# EAGLE schematic IQOV-162 Evo Board (EAGLE 9.7.0)
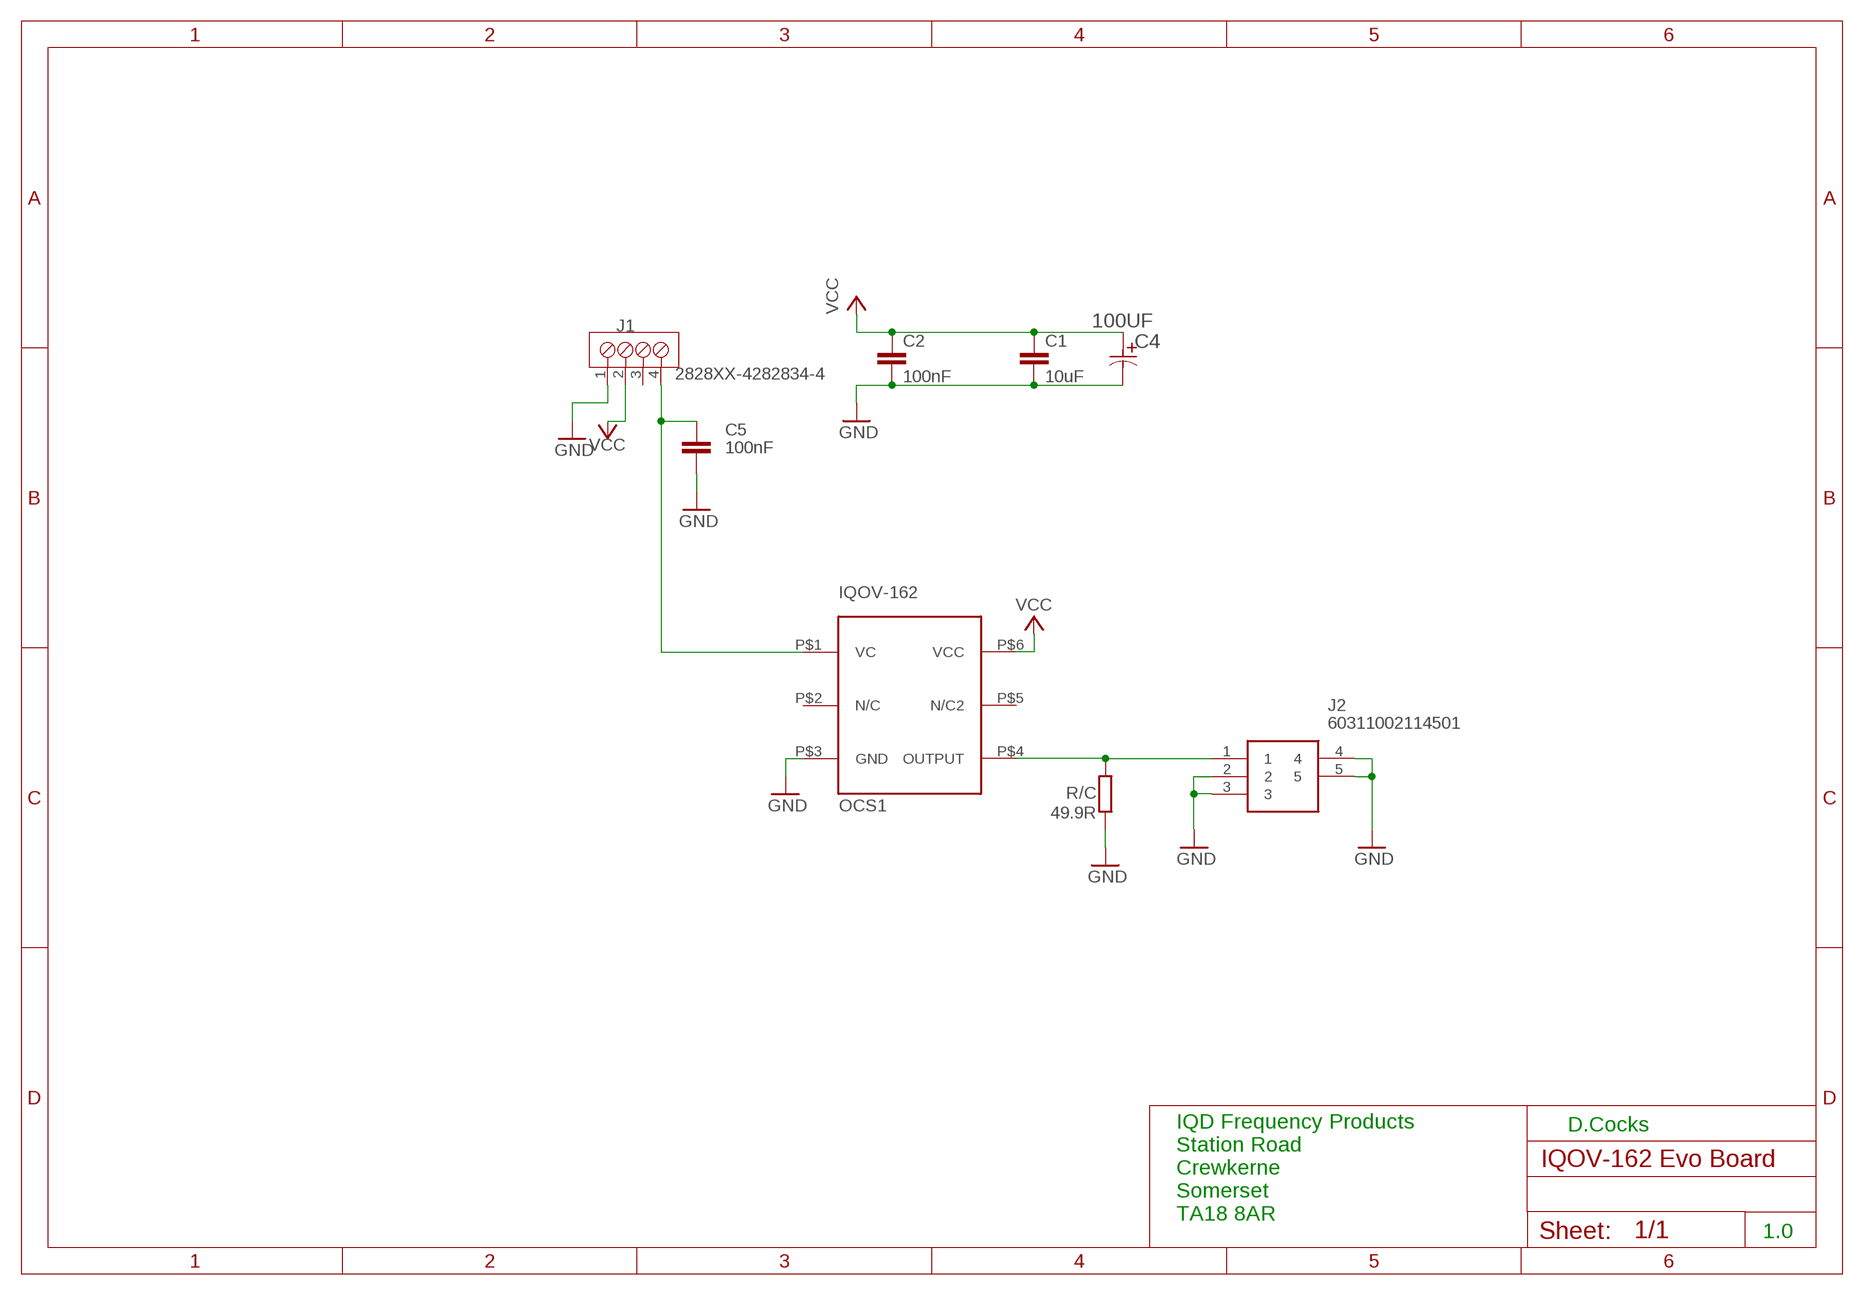
[diagram p0: schematic, sheet 1]

## Parts
C1  10uF  C-EUC0805  [C0805]
C2  100nF  C-EUC0805  [C0805]
C4  100UF  EEE-FK0J101UR-CASE-C  [CAPAE530X610N]
C5  100nF  C-EUC0805  [C0805]
J1  2828XX-4282834-4  [TERMBLK_254-4N]
J2  60311002114501  60312002114503  [60312002114503]
OCS1  IQOV-162  [IQOV-162]
R/C  49.9R  R-EU_M1206  [M1206]

## Nets
GND: C1.2 C2.2 C4.2 C5.2 J1.1 J2.2 J2.3 J2.4 J2.5 OCS1.P$3(GND) R/C.1
N$2: J2.1 OCS1.P$4(OUTPUT) R/C.2
N$6: C5.1 J1.4 OCS1.P$1(VC)
VCC: C1.1 C2.1 C4.1 J1.2 OCS1.P$6(VCC)
Unconnected: J1.3 OCS1.P$2(N/C) OCS1.P$5(N/C2)

## Notes on the sheet
- D.Cocks
- IQD Frequency Products
  Station Road
  Crewkerne
  Somerset
  TA18 8AR
- 1.0

## Library data of the parts
C1 C2 C5 = resistor:C-EU: CAPACITOR, European symbol
C4 = Panasonic-EEEFK_EEEFP:EEE-: Aluminum Electrolytic Capacitors,Surface Mount Type; MPN: EEE-FK0J101UR; OC_FARNELL: 1850085; OC_NEWARK: 23T0829; PACKAGE: CASE-C; SUPPLIER: PANASONIC; TOLERANCE: ±20 %; VOLTAGERATING: 6.3V
J1 = Connector:2828XX-4: 4 Position Wire to Board Terminal Block Horizontal with Board Reference: Datasheet <https://www.te.com.cn/commerce/DocumentDelivery/DDEController?Action=showdoc&DocId=Catalog+Section%7F1308389_EUROSTYLE_TERMINAL_BLOCKS%7F0607%7Fpdf%7FEnglish%7FENG_CS_1308389_EUROSTYLE_TERMINAL_BLOCKS_0607.pdf%7F2-282837-5>; CATEGORY: Connectors; DATASHEET: https://www.te.com/usa-en/product-282834-4.datasheet.pdf; DESCRIPTION: 4 Position Wire to Board Terminal Block Horizontal with Board 0.100" (2.54mm) Through Hole; MANUFACTURER: TE Connectivity AMP Connectors; MPN: 282834-4; OPERATING_TEMPERATURE: -40°C ~ 105°C; PACKAGE_SIZE: NA; PACKAGE_TYPE: Through Hole; PART_STATUS: Active; PITCH: 0.100" (2.54mm); ROHS: Compliant; SERIES: Buchanan; SUBCATEGORY: Terminal Blocks; TYPE: Screw Terminal - Rising Cage Clamp Side Wire Entry
J2 = 60312002114503:60312002114503: Wurth Elektronik, WR-SMA Straight PCB Mount Coaxial Connector, jack, Gold over Nickel, Solder Termination Source: Datasheet <https://katalog.we-online.de/em/datasheet/60312002114503.pdf>; DESCRIPTION: Wurth Elektronik, WR-SMA Straight PCB Mount Coaxial Connector, jack, Gold over Nickel, Solder Termination; HEIGHT: 9.56mm; MANUFACTURER_NAME: Wurth Elektronik; MANUFACTURER_PART_NUMBER: 60312002114503; MOUSER_PART_NUMBER: 710-60312002114503; MOUSER_PRICE-STOCK: https://www.mouser.co.uk/ProductDetail/Wurth-Elektronik/60312002114503?qs=3jNSNtuqJTL%2FGpZA1FAOxw%3D%3D
OCS1 = IQD-Frequency-Products:IQOV-162
R/C = resistor:R-EU_: RESISTOR, European symbol